# Altium project E-pico_V1.PrjPcb
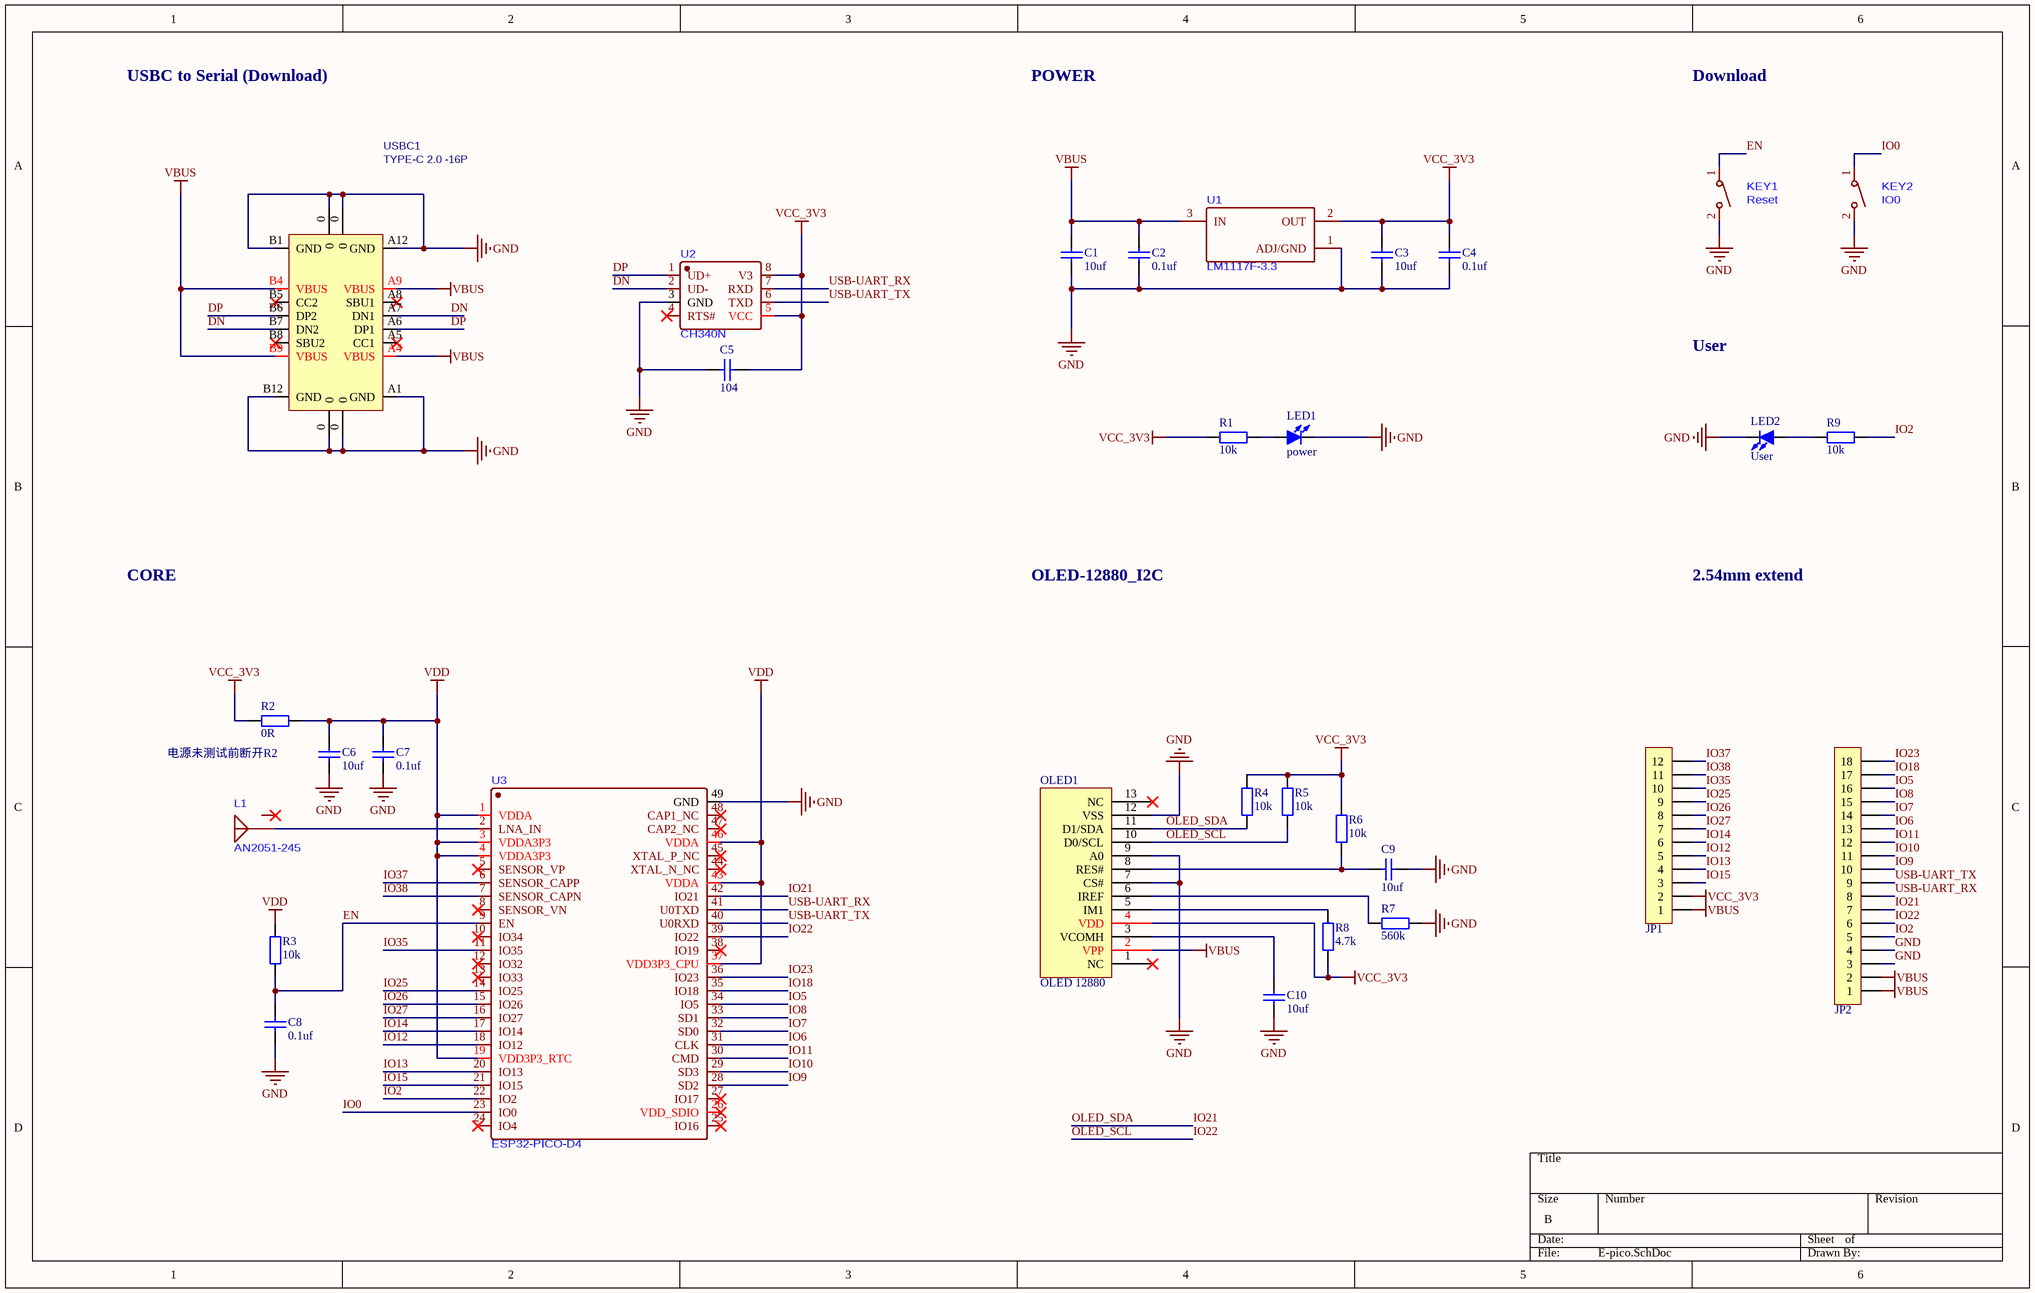
[diagram p0: E-pico.SchDoc]
1 sheet, 31 parts. Net scope: global (net labels, ports and power ports of the same name join across sheets).
Board file: E-pico.PcbDoc

## Sheet E-pico.SchDoc
size B; SheetNumber: 1; SheetTotal: 1

### Parts
C1  10uf  [C0603_M]
C2  0.1uf  [C0603_M]
C3  10uf  [C0603_M]
C4  0.1uf  [C0603_M]
C5  104  [C0603_M]
C6  10uf  [C0603_M]
C7  0.1uf  [C0603_M]
C8  0.1uf  [C0603_M]
C9  10uf  [C0603_M]
C10  10uf  [C0603_M]
JP1  HDR-1X12  [HDR2.54-LI-12P]  (value not drawn)
JP2  HDR-1X18  [HDR2.54-LI-18P]  (value not drawn)
KEY1  Reset  [SW-SMD_ST-1186S]
KEY2  IO0  [SW-SMD_ST-1186S]
L1  AN2051-245  [ANT2051]
LED1  power  [LED0603_Y]
LED2  User  [LED0603_Y]
OLED1  OLED 12880  [0.78'OLED-12880-13pin-short]
R1  10k  [R0603_M]
R2  0R  [R0603_M]
R3  10k  [R0603_M]
R4  10k  [R0603_M]
R5  10k  [R0603_M]
R6  10k  [R0603_M]
R7  560k  [R0603_M]
R8  4.7k  [R0603_M]
R9  10k  [R0603_M]
U1  LM1117F-3.3  [SOT89-150P410X160-3N]
U2  CH340N  [SOP-8_L5.0-W4.0-P1.27-LS6.0-BL]
U3  ESP32-PICO-D4  [QFN-48_L7.0-W7.0-P0.50-BL-EP5.4]
USBC1  TYPE-C 2.0 -16P  [USB-C-SMD_16P]

### Nets
GND: C1.2 C2.2 C3.2 C4.2 C5.1 C6.1 C7.1 C8.1 C9.1 C10.1 JP2.3 JP2.4 KEY1.2 KEY2.2 LED1.2(K) LED2.2(K) OLED1.7(CS#) OLED1.9(A0) OLED1.12(VSS) R7.1 U1.1(ADJ/GND) U2.3(GND) U3.49(GND) USBC1.0 USBC1.A1(GND) USBC1.A12(GND) USBC1.B1(GND) USBC1.B12(GND)
VBUS: C1.1 C2.1 JP1.1 JP2.1 JP2.2 OLED1.2(VPP) U1.3(IN) USBC1.A4(VBUS) USBC1.A9(VBUS) USBC1.B4(VBUS) USBC1.B9(VBUS)
VCC_3V3: C3.1 C4.1 C5.2 JP1.2 OLED1.4(VDD) R1.1 R2.1 R4.1 R5.1 R6.1 R8.1 U1.2(OUT) U2.5(VCC) U2.8(V3)
VDD: C6.2 C7.2 R2.2 R3.1 U3.1(VDDA) U3.3(VDDA3P3) U3.4(VDDA3P3) U3.19(VDD3P3_RTC) U3.37(VDD3P3_CPU) U3.43(VDDA) U3.46(VDDA)
DN: U2.2(UD-) USBC1.A7(DN1) USBC1.B7(DN2)
DP: U2.1(UD+) USBC1.A6(DP1) USBC1.B6(DP2)
EN: C8.2 KEY1.1 R3.2 U3.9(EN)
IO0: KEY2.1 U3.23(IO0)
IO2: JP2.5 R9.1 U3.22(IO2)
IO5: JP2.16 U3.34(IO5)
IO6: JP2.13 U3.31(CLK)
IO7: JP2.14 U3.32(SD0)
IO8: JP2.15 U3.33(SD1)
IO9: JP2.10 U3.28(SD2)
IO10: JP2.11 U3.29(SD3)
IO11: JP2.12 U3.30(CMD)
IO12: JP1.5 U3.18(IO12)
IO13: JP1.4 U3.20(IO13)
IO14: JP1.6 U3.17(IO14)
IO15: JP1.3 U3.21(IO15)
IO18: JP2.17 U3.35(IO18)
IO21: JP2.7 OLED1.11(D1/SDA) R4.2 U3.42(IO21)  [also labelled OLED_SDA]
IO22: JP2.6 OLED1.10(D0/SCL) R5.2 U3.39(IO22)  [also labelled OLED_SCL]
IO23: JP2.18 U3.36(IO23)
IO25: JP1.9 U3.14(IO25)
IO26: JP1.8 U3.15(IO26)
IO27: JP1.7 U3.16(IO27)
IO35: JP1.10 U3.11(IO35)
IO37: JP1.12 U3.6(SENSOR_CAPP)
IO38: JP1.11 U3.7(SENSOR_CAPN)
USB-UART_RX: JP2.8 U2.7(RXD) U3.41(U0TXD)
USB-UART_TX: JP2.9 U2.6(TXD) U3.40(U0RXD)
NetC9_2: C9.2 OLED1.8(RES#) R6.2
NetC10_2: C10.2 OLED1.3(VCOMH)
NetL1_1: L1.1(ANT) U3.2(LNA_IN)
NetLED1_1: LED1.1(A) R1.2
NetLED2_1: LED2.1(A) R9.2
NetOLED1_5: OLED1.5(IM1) R8.2
NetOLED1_6: OLED1.6(IREF) R7.2

Not connected (* = marked no-connect by the designer): L1 2*; OLED1 1(NC)* 13(NC)*; U2 4(RTS#)*; U3 5(SENSOR_VP)* 8(SENSOR_VN)* 10(IO34)* 12(IO32)* 13(IO33)* 24(IO4)* 25(IO16)* 26(VDD_SDIO)* 27(IO17)* 38(IO19)* 44(XTAL_N_NC)* 45(XTAL_P_NC)* 47(CAP2_NC)* 48(CAP1_NC)*; USBC1 A5(CC1)* A8(SBU1)* B5(CC2)* B8(SBU2)*

### Notes on the sheet
- USBC to Serial (Download)
- POWER
- Download
- User
- CORE
- OLED-12880_I2C
- 2.54mm extend
- 电源未测试前断开R2

### Library data of the parts
C1-C10 = C: 贴片电容/MLCC电容; BOM名称: 无极性贴片电容; 联系卖家，免费查找封装: 唯一出售店铺网址https://shop463601444.taobao.com
JP1 = Header 12: 12P接插件; 联系卖家，免费查找封装: 唯一出售店铺网址https://shop463601444.taobao.com; 封装库来自淘宝卖家ID:黄晶宝石: 其他店铺购入均为盗版假冒封装库，请立即申请退款，本店现金奖励20~200元; BOM名称: 12P接插件
JP2 = Header 18: 18P接插件; 联系卖家，免费查找封装: 唯一出售店铺网址https://shop463601444.taobao.com; 封装库来自淘宝卖家ID:黄晶宝石: 其他店铺购入均为盗版假冒封装库，请立即申请退款，本店现金奖励20~200元; BOM名称: 18P接插件
KEY1 KEY2 = 侧按小龟ST-1186S: C589199
LED1 LED2 = LED-SMD: 贴片LED; 封装库来自淘宝卖家ID：黄晶宝石: 其他店铺购入均为盗版封装库，请立即申请退款，本店现金奖励20~200元; BOM名称: 贴片LED
OLED1 = 0.78寸12880oled
R1-R9 = R: 贴片电阻; 联系卖家，免费查找封装: 唯一出售店铺网址https://shop463601444.taobao.com; BOM名称: 贴片电阻
USBC1 = USB2.0_Type-C_16Pin: USB2.0_Type-C_16Pin母座; 联系卖家 免费技术支持: 封装库来自淘宝卖家ID：黄晶宝石